# EAGLE schematic untitled (EAGLE 7.7.0)
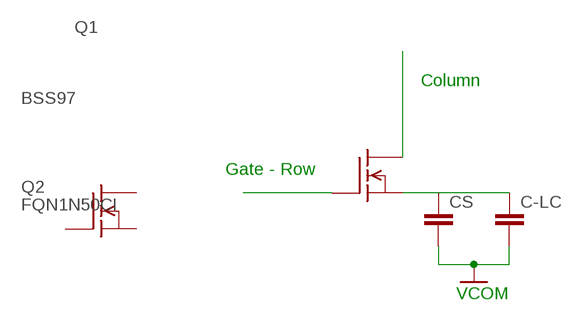
[diagram p0: schematic, sheet 1]

## Parts
C-LC  CAP0402-CAP  [0402-CAP]
CS  CAP0402-CAP  [0402-CAP]
Q1  BSS97  [TO202]
Q2  FQN1N50CI  [TO92-INLINE]

## Nets
GND: C-LC.2 CS.2
N$1: C-LC.1 CS.1 Q1.1(S)
N$2: Q1.2(D)
N$4: Q1.3(G)
Unconnected: Q2.1(D) Q2.2(G) Q2.3(S)

## Notes on the sheet
- Column
- Gate - Row
- VCOM

## Library data of the parts
C-LC CS = SparkFun-Capacitors:CAP: Capacitor Standard 0603 ceramic capacitor, and 0.1" leaded capacitor.
Q1 = transistor-fet:BSS97: N-Channel Enhancement MOSFET 200V; 1.5A; 1,6Ohm
Q2 = adafruit:FQN1N50C: N-Channel Enhancement MOSFET 500V, 0.4A, 6.0 Ohm